# EAGLE schematic SNES_RGBAmp_wCSYNC (EAGLE 7.7.0)
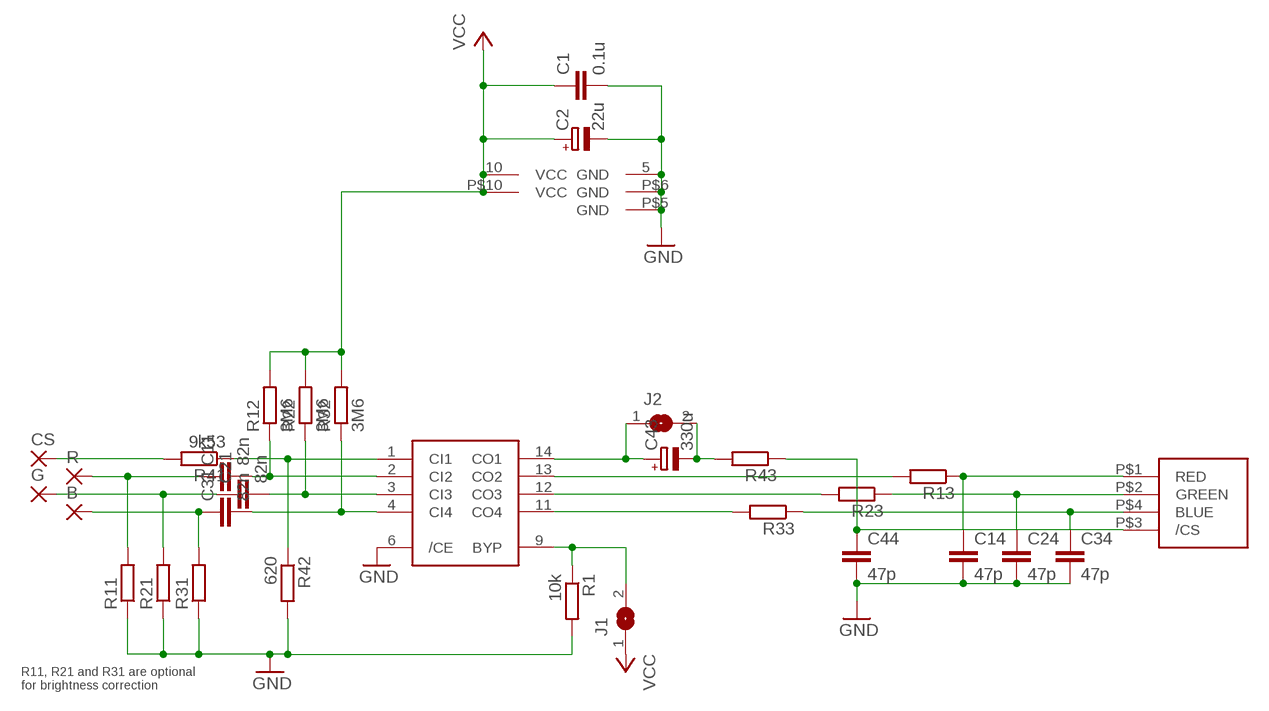
[diagram p0: schematic, sheet 1]

## Parts
B  SMD2  [SMD1,27-2,54]
C1  0.1u  C-EUC0603K  [C0603K]
C2  22u  CPOL-EUSMCB  [SMC_B]
C11  82n  C-EUC0603K  [C0603K]
C14  47p  C-EUC0603K  [C0603K]
C21  82n  C-EUC0603K  [C0603K]
C24  47p  C-EUC0603K  [C0603K]
C31  82n  C-EUC0603K  [C0603K]
C34  47p  C-EUC0603K  [C0603K]
C43  330u  CPOL-EUSMCD  [SMC_D]
C44  47p  C-EUC0603K  [C0603K]
CS  SMD2  [SMD1,27-2,54]
G  SMD2  [SMD1,27-2,54]
J1  SJ  [SJ]
J2  SJ  [SJ]
J3  SNES_MULTIAV_RGBC_ONLY  [SNES_MULTIAV_RGBC_ONLY]
R  SMD2  [SMD1,27-2,54]
R1  10k  R-EU_R0603  [R0603]
R11  R-EU_R0603  [R0603]
R12  3M6  R-EU_R0603  [R0603]
R13  R-EU_R0603  [R0603]
R21  R-EU_R0603  [R0603]
R22  3M6  R-EU_R0603  [R0603]
R23  R-EU_R0603  [R0603]
R31  R-EU_R0603  [R0603]
R32  3M6  R-EU_R0603  [R0603]
R33  R-EU_R0603  [R0603]
R41  9k53  R-EU_R0603  [R0603]
R42  620  R-EU_R0603  [R0603]
R43  R-EU_R0603  [R0603]
U1  THS7374  [THS7374]

## Nets
GND: C1.2 C2.- C14.2 C24.2 C34.2 C44.2 J3.P$5(GND) J3.P$6(GND) R1.2 R11.1 R21.1 R31.1 R42.2 U1.5(GND) U1.6(/CE)
N$1: C11.2 R12.1 U1.2(CI2)
N$2: C21.2 R22.1 U1.3(CI3)
N$3: J1.2 R1.1 U1.9(BYP)
N$4: C44.1 J3.P$3(/CS) R43.1
N$5: C14.1 J3.P$1(RED) R13.1
N$6: C24.1 J3.P$2(GREEN) R23.1
N$7: R23.2 U1.12(CO3)
N$8: R13.2 U1.13(CO2)
N$9: C34.1 J3.P$4(BLUE) R33.1
N$10: R41.1 R42.1 U1.1(CI1)
N$11: R33.2 U1.11(CO4)
N$14: C11.1 R11.2 R.1(P)
N$15: C21.1 G.1(P) R21.2
N$16: B.1(P) C31.1 R31.2
N$17: CS.1(P) R41.2
N$18: C43.+ J2.1 U1.14(CO1)
N$19: C43.- J2.2 R43.2
R9: C31.2 R32.1 U1.4(CI4)
VCC: C1.1 C2.+ J1.1 J3.P$10(VCC) R12.2 R22.2 R32.2 U1.10(VCC)

## Notes on the sheet
- R11, R21 and R31 are optional
  for brightness correction

## Library data of the parts
B CS G R = wirepad:SMD2: SMD PAD
C1 C11 C14 C21 C24 C31 C34 C44 = rcl:C-EU: CAPACITOR, European symbol
C2 C43 = rcl:CPOL-EU: POLARIZED CAPACITOR, European symbol
J1 J2 = jumper:SJ: SMD solder JUMPER
J3 = snes_div:SNES_MULTIAV_RGBC_ONLY
R1 R11-R13 R21-R23 R31-R33 R41-R43 = rcl:R-EU_: RESISTOR, European symbol
U1 = snes_div:THS7374